# Altium project ardu-shield.PrjPcb
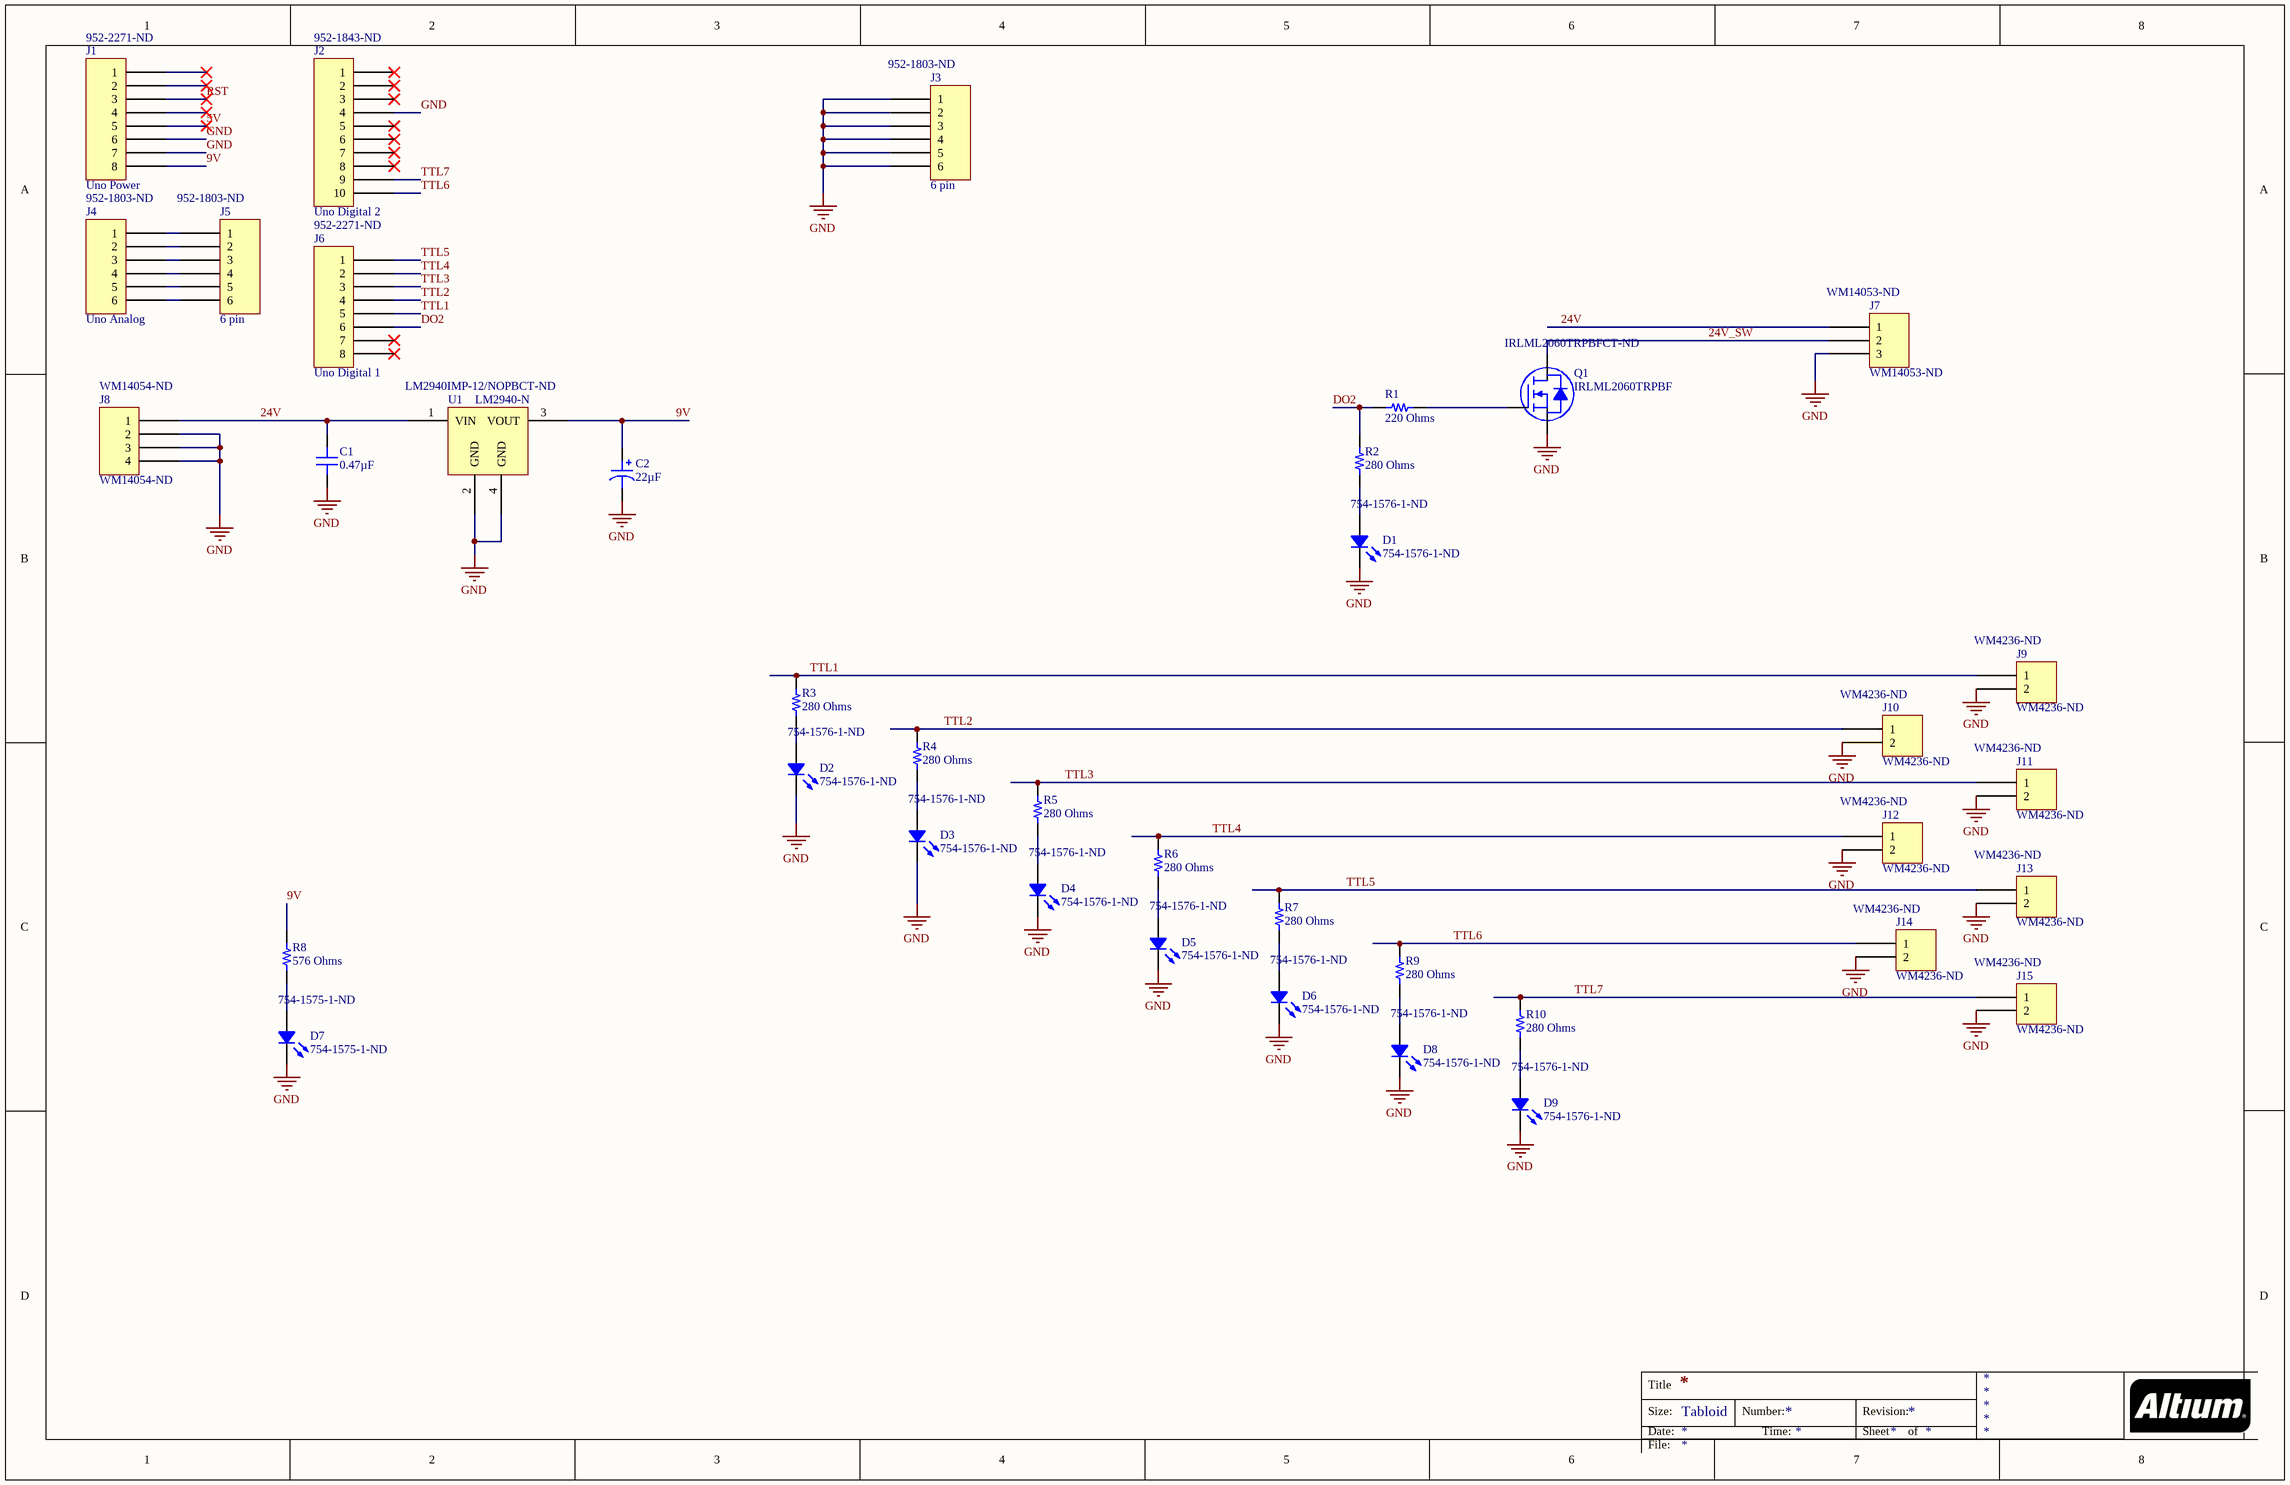
[diagram p0: ardu-shield.SchDoc]
1 sheet, 38 parts. Net scope: global (net labels, ports and power ports of the same name join across sheets).
Board file: ardu-shield.PcbDoc

## Sheet ardu-shield.SchDoc
size Tabloid

### Parts
C1  0.47µF  [CAP 0805_2012]
C2  22µF  [CAP POL 2917_7343]
D1  754-1576-1-ND  [APA3010]
D2  754-1576-1-ND  [APA3010]
D3  754-1576-1-ND  [APA3010]
D4  754-1576-1-ND  [APA3010]
D5  754-1576-1-ND  [APA3010]
D6  754-1576-1-ND  [APA3010]
D7  754-1575-1-ND  [APA3010]
D8  754-1576-1-ND  [APA3010]
D9  754-1576-1-ND  [APA3010]
J1  Uno Power  Supplier Part Number 1: 952-2271-ND  [Pin Header 1x8 TH Pitch 2.54mm]
J2  Uno Digital 2  Supplier Part Number 1: 952-1843-ND  [Pin Header 1x10 TH Pitch 2.54mm]
J3  6 pin  Supplier Part Number 1: 952-1803-ND  [Pin Header 1x6 TH Pitch 2.54mm]
J4  Uno Analog  Supplier Part Number 1: 952-1803-ND  [Pin Header 1x6 TH Pitch 2.54mm]
J5  6 pin  Supplier Part Number 1: 952-1803-ND  [Pin Header 1x6 TH Pitch 2.54mm]
J6  Uno Digital 1  Supplier Part Number 1: 952-2271-ND  [Pin Header 1x8 TH Pitch 2.54mm]
J7  WM14053-ND  [Molex SL 70551* 3PIN]
J8  WM14054-ND  [Molex SL 70551* 4PIN]
J9  WM4236-ND  [Molex SL 70551* 2pin]
J10  WM4236-ND  [Molex SL 70551* 2pin]
J11  WM4236-ND  [Molex SL 70551* 2pin]
J12  WM4236-ND  [Molex SL 70551* 2pin]
J13  WM4236-ND  [Molex SL 70551* 2pin]
J14  WM4236-ND  [Molex SL 70551* 2pin]
J15  WM4236-ND  [Molex SL 70551* 2pin]
Q1  IRLML2060TRPBF  Supplier Part Number 1: IRLML2060TRPBFCT-ND  [INFINEON SOT-23-3]
R1  220 Ohms  [RES 0805_2012]
R2  280 Ohms  [RES 0805_2012]
R3  280 Ohms  [RES 0805_2012]
R4  280 Ohms  [RES 0805_2012]
R5  280 Ohms  [RES 0805_2012]
R6  280 Ohms  [RES 0805_2012]
R7  280 Ohms  [RES 0805_2012]
R8  576 Ohms  [RES 0805_2012]
R9  280 Ohms  [RES 0805_2012]
R10  280 Ohms  [RES 0805_2012]
U1  LM2940-N  Supplier Part Number 1: LM2940IMP-12/NOPBCT-ND  [SOT223_M]

### Nets
GND: C1.1 C2.2 D1.1 D2.1 D3.1 D4.1 D5.1 D6.1 D7.1 D8.1 D9.1 J1.6 J1.7 J2.4 J3.1 J3.2 J3.3 J3.4 J3.5 J3.6 J7.3 J8.2 J8.3 J8.4 J9.2 J10.2 J11.2 J12.2 J13.2 J14.2 J15.2 Q1.2(S) U1.2(GND) U1.4(GND)
5V: J1.5
9V: C2.1 J1.8 R8.2 U1.3(VOUT)
24V: C1.2 J7.1 J8.1 U1.1(VIN)
24V_SW: J7.2 Q1.3(D)
DO2: J6.6 R1.1 R2.2
RST: J1.3
TTL1: J6.5 J9.1 R3.2
TTL2: J6.4 J10.1 R4.2
TTL3: J6.3 J11.1 R5.2
TTL4: J6.2 J12.1 R6.2
TTL5: J6.1 J13.1 R7.2
TTL6: J2.10 J14.1 R9.2
TTL7: J2.9 J15.1 R10.2
NetD1_2: D1.2 R2.1
NetD2_2: D2.2 R3.1
NetD3_2: D3.2 R4.1
NetD4_2: D4.2 R5.1
NetD5_2: D5.2 R6.1
NetD6_2: D6.2 R7.1
NetD7_2: D7.2 R8.1
NetD8_2: D8.2 R9.1
NetD9_2: D9.2 R10.1
NetJ4_1: J4.1 J5.1
NetJ4_2: J4.2 J5.2
NetJ4_3: J4.3 J5.3
NetJ4_4: J4.4 J5.4
NetJ4_5: J4.5 J5.5
NetJ4_6: J4.6 J5.6
NetQ1_1: Q1.1(G) R1.2

Not connected (* = marked no-connect by the designer): J1 1* 2* 4*; J2 1* 2* 3* 5* 6* 7* 8*; J6 7* 8*

### Notes on the sheet
- Title
- Size:
- Date:
- Tabloid
- Number:
- Time:
- Revision:
- Sheet
- of
- File:

### Library data of the parts
C1 = C0805C474K5RACAUTO: CAP CER 0.47UF 50V X7R 0805; Manufacturer: KEMET; Tolerance: ±10%; Part Number: C0805C474K5RACAUTO; Value: 0.47µF; Applications: Automotive, Bypass, Decoupling; Capacitance: 0.47µF; ComponentLink1Description: Datasheet; ComponentLink1URL: https://api.kemet.com/component-edge/download/datasheet/C0805C474K5RACAUTO.pdf; ComponentLink2Description: DigiKey Link; ComponentLink2URL: http://digikey.com/product-detail/en/kemet/C0805C474K5RACAUTO/399-6976-1-ND/3314485; Device Package: 0805 (2012 Metric); LastUpdated: 1/21/2020 12:03:05 AM; Lifecycle Status: Active; Minimum Order: 1; Mounting Type: Surface Mount, MLCC; Operating Temperature: -55°C ~ 125°C; Package / Case: 0805 (2012 Metric); Packaging: TapeAndReel; PartId: 2727; Part Status: Active; Price: 0.08; Ratings: AEC-Q200; Series: SMD Auto X7R; Size / Dimension: 0.079" L x 0.049" W (2.00mm x 1.25mm); Supplier 1: DigiKey; Supplier Part Number 1: 399-6976-1-ND; Temperature Coefficient: X7R; Thickness (Max): 0.043" (1.10mm); Voltage - Rated: 50V
C2 = T491D226K025AT: CAP TANT 22UF 10% 25V 2917; Manufacturer: KEMET; Manufacturer Size Code: D; ESR (Equivalent Series Resistance): 800mOhm; Lifetime @ Temp.: 2000 Hrs @ 125°C; Type: Molded; Part Number: T491D226K025AT; Value: 22µF; Capacitance: 22µF; ComponentLink1Description: Datasheet; ComponentLink1URL: https://api.kemet.com/component-edge/download/datasheet/T491D226K025AT.pdf; ComponentLink2Description: DigiKey Link; ComponentLink2URL: http://digikey.com/product-detail/en/kemet/T491D226K025AT/399-3782-1-ND/819107; Device Package: 2917 (7343 Metric); Features: General Purpose; Height - Seated (Max): 0.122" (3.10mm); LastUpdated: 1/21/2020 2:02:25 AM; Lifecycle Status: Active; Minimum Order: 1; Mounting Type: Surface Mount; Operating Temperature: -55°C ~ 125°C; Package / Case: 2917 (7343 Metric); Packaging: TapeAndReel; PartId: 1471; Part Status: Active; Price: 0.37; Series: T491; Size / Dimension: 0.287" L x 0.169" W (7.30mm x 4.30mm); Supplier 1: DigiKey; Supplier Part Number 1: 399-3782-1-ND; Tolerance: ±10%; Voltage - Rated: 25V
D1-D9 = LED: Supplier 1: Digi-Key
  D1-D6 D8 D9: Supplier Part Number 1: 754-1576-1-ND
  D7: Supplier Part Number 1: 754-1575-1-ND
J1 J6 = 8 pin: Supplier 1: Digi-Key
J2 = 10 pin: Supplier 1: Digi-Key
J4 = 6 pin: Supplier 1: Digi-Key
J7 = 3 pin: Supplier 1: Digi-Key; Supplier Part Number 1: WM14053-ND
J8 = 4 pin: Supplier 1: Digi-Key; Supplier Part Number 1: WM14054-ND
J9-J15 = 2 pin: Supplier 1: Digi-Key; Supplier Part Number 1: WM4236-ND
Q1 = IRLML2060TRPBF: MOSFET N-CH 60V 1.2A SOT23-3; Manufacturer: Infineon Technologies; Current - Continuous Drain (Id) @ 25°C: 1.2A (Ta); Drive Voltage (Max Rds On,  Min Rds On): 4.5V, 10V; FET Type: N-Channel; Gate Charge (Qg) (Max) @ Vgs: 0.67nC @ 4.5V; Input Capacitance (Ciss) (Max) @ Vds: 64pF @ 25V; Power Dissipation (Max): 1.25W (Ta); Rds On (Max) @ Id, Vgs: 480mOhm @ 1.2A, 10V; Vgs (Max): ±16V; Vgs(th) (Max) @ Id: 2.5V @ 25µA; Part Number: IRLML2060TRPBF; ComponentLink1Description: Datasheet; ComponentLink1URL: https://www.infineon.com/dgdl/irlml2060pbf.pdf?fileId=5546d462533600a401535664b7fb25ee; ComponentLink2Description: DigiKey Link; ComponentLink2URL: http://digikey.com/product-detail/en/infineon-technologies/IRLML2060TRPBF/IRLML2060TRPBFCT-ND/2271917; Device Package: TO-236-3, SC-59, SOT-23-3; Drain to Source Voltage (Vdss): 60V; LastUpdated: 1/21/2020 4:00:48 AM; Lifecycle Status: Active; Minimum Order: 1; Mounting Type: Surface Mount; Operating Temperature: -55°C ~ 150°C (TJ); Package / Case: TO-236-3, SC-59, SOT-23-3; Packaging: TapeAndReel; Part Status: Active; Price: 0.10; Series: HEXFET®; Supplier Device Package: Micro3™/SOT-23; Technology: MOSFET (Metal Oxide); Supplier 1: Digi-Key
R1 = RR1220P-221-D: RES SMD 220 OHM 0.5% 1/10W 0805; Manufacturer: Susumu; Power (Watts): 0.1W, 1/10W; Temperature Coefficient: ±25ppm/°C; Part Number: RR1220P-221-D; Value: 220 Ohms; ComponentLink1Description: Datasheet; ComponentLink1URL: http://www.susumu.co.jp/common/pdf/n_catalog_partition05_en.pdf; ComponentLink2Description: DigiKey Link; ComponentLink2URL: http://digikey.com/product-detail/en/susumu/RR1220P-221-D/RR12P220DCT-ND/432814; Composition: Thin Film; Device Package: 0805 (2012 Metric); Height - Seated (Max): 0.020" (0.50mm); LastUpdated: 1/21/2020 1:45:01 AM; Lifecycle Status: Active; Minimum Order: 1; Number of Terminations: 2; Operating Temperature: -55°C ~ 125°C; Package / Case: 0805 (2012 Metric); Packaging: TapeAndReel; PartId: 39160; Part Status: Active; Price: 0.01; Resistance: 220 Ohms; Series: RR; Size / Dimension: 0.079" L x 0.049" W (2.00mm x 1.25mm); Supplier 1: DigiKey; Supplier Part Number 1: RR12P220DCT-ND; Tolerance: ±0.5%
R2-R7 R9 R10 = RK73H2ATTD2800F: RESISTOR; Manufacturer: KOA Speer Electronics, Inc.; Power (Watts): 0.25W, 1/4W; Temperature Coefficient: ±100ppm/°C; Tolerance: ±1%; Part Number: RK73H2ATTD2800F; Value: 280 Ohms; ComponentLink1Description: Datasheet; ComponentLink1URL: http://www.koaspeer.com/catimages/Products/RK73H/RK73H.pdf; ComponentLink2Description: DigiKey Link; ComponentLink2URL: http://digikey.com/product-detail/en/koa-speer-electronics-inc/RK73H2ATTD2800F/2019-RK73H2ATTD2800FCT-ND/10234507; Composition: Thick Film; Device Package: 0805 (2012 Metric); Features: Automotive AEC-Q200, Moisture Resistant; Height - Seated (Max): 0.024" (0.60mm); LastUpdated: 1/21/2020 1:40:01 AM; Lifecycle Status: Active; Minimum Order: 1; Number of Terminations: 2; Operating Temperature: -55°C ~ 155°C; Package / Case: 0805 (2012 Metric); Packaging: CutTape; PartId: 48310; Part Status: Active; Price: 0.10; Ratings: AEC-Q200; Resistance: 280 Ohms; Series: RK73H; Size / Dimension: 0.079" L x 0.049" W (2.00mm x 1.25mm); Supplier 1: DigiKey; Supplier Part Number 1: 2019-RK73H2ATTD2800FCT-ND; Supplier Device Package: 0805
R8 = RK73H2ATTD5760F: RESISTOR; Manufacturer: KOA Speer Electronics, Inc.; Power (Watts): 0.25W, 1/4W; Temperature Coefficient: ±100ppm/°C; Tolerance: ±1%; Part Number: RK73H2ATTD5760F; Value: 576 Ohms; ComponentLink1Description: Datasheet; ComponentLink1URL: http://www.koaspeer.com/catimages/Products/RK73H/RK73H.pdf; ComponentLink2Description: DigiKey Link; ComponentLink2URL: http://digikey.com/product-detail/en/koa-speer-electronics-inc/RK73H2ATTD5760F/2019-RK73H2ATTD5760FCT-ND/10234051; Composition: Thick Film; Device Package: 0805 (2012 Metric); Features: Automotive AEC-Q200, Moisture Resistant; Height - Seated (Max): 0.024" (0.60mm); LastUpdated: 1/21/2020 1:41:18 AM; Lifecycle Status: Active; Minimum Order: 1; Number of Terminations: 2; Operating Temperature: -55°C ~ 155°C; Package / Case: 0805 (2012 Metric); Packaging: CutTape; PartId: 46940; Part Status: Active; Price: 0.10; Ratings: AEC-Q200; Resistance: 576 Ohms; Series: RK73H; Size / Dimension: 0.079" L x 0.049" W (2.00mm x 1.25mm); Supplier 1: DigiKey; Supplier Part Number 1: 2019-RK73H2ATTD5760FCT-ND; Supplier Device Package: 0805
J3 J5 = 6 pin: Supplier 1: Digi-Key
U1 = LM2940-N: Supplier 1: Digi-Key